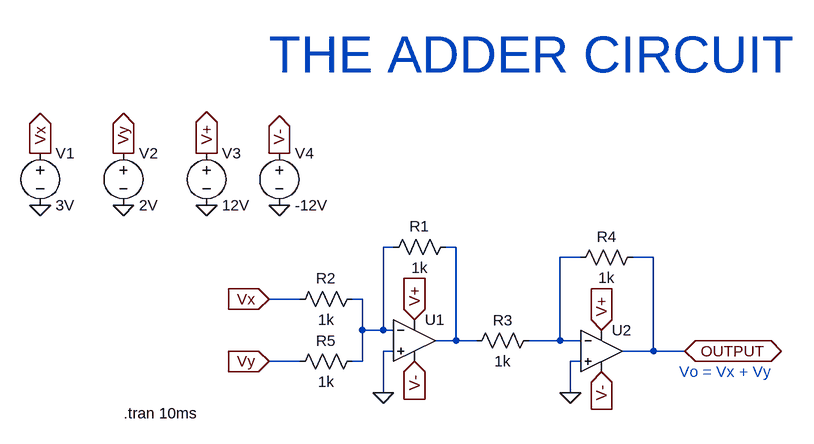
[diagram p0: schematic Adder.asc]
Adder.asc, the LTspice schematic file:
Version 4
SHEET 1 880 680
WIRE 16 32 0 32
WIRE 112 32 96 32
WIRE 304 48 272 48
WIRE 416 48 384 48
WIRE -128 112 -176 112
WIRE -32 112 -48 112
WIRE -32 160 -32 112
WIRE 0 160 0 32
WIRE 0 160 -32 160
WIRE 16 160 0 160
WIRE 112 176 112 32
WIRE 112 176 80 176
WIRE 144 176 112 176
WIRE 272 176 272 48
WIRE 272 176 224 176
WIRE 304 176 272 176
WIRE 16 192 0 192
WIRE 416 192 416 48
WIRE 416 192 368 192
WIRE 464 192 416 192
WIRE -128 208 -176 208
WIRE -32 208 -32 160
WIRE -32 208 -48 208
WIRE 304 208 288 208
WIRE 0 256 0 192
WIRE 288 256 288 208
FLAG 0 256 0
FLAG 288 256 0
FLAG -528 -32 0
FLAG -400 -32 0
FLAG -272 -32 0
FLAG -160 -32 0
FLAG -528 -112 Vx
IOPIN -528 -112 Out
FLAG -400 -112 Vy
IOPIN -400 -112 Out
FLAG -272 -112 V+
IOPIN -272 -112 Out
FLAG -160 -112 V-
IOPIN -160 -112 Out
FLAG -176 112 Vx
IOPIN -176 112 In
FLAG -176 208 Vy
IOPIN -176 208 In
FLAG 48 144 V+
IOPIN 48 144 In
FLAG 336 160 V+
IOPIN 336 160 In
FLAG 48 208 V-
IOPIN 48 208 In
FLAG 336 224 V-
IOPIN 336 224 In
FLAG 464 192 OUTPUT
IOPIN 464 192 BiDir
SYMBOL Opamps\\UniversalOpamp2 48 176 R0
SYMATTR InstName U1
SYMBOL res 112 16 R90
WINDOW 0 0 56 VBottom 2
WINDOW 3 32 56 VTop 2
SYMATTR InstName R1
SYMATTR Value 1k
SYMBOL res 240 160 R90
WINDOW 0 0 56 VBottom 2
WINDOW 3 32 56 VTop 2
SYMATTR InstName R3
SYMATTR Value 1k
SYMBOL res 400 32 R90
WINDOW 0 0 56 VBottom 2
WINDOW 3 32 56 VTop 2
SYMATTR InstName R4
SYMATTR Value 1k
SYMBOL Opamps\\UniversalOpamp2 336 192 R0
SYMATTR InstName U2
SYMBOL res -32 192 R90
WINDOW 0 0 56 VBottom 2
WINDOW 3 32 56 VTop 2
SYMATTR InstName R5
SYMATTR Value 1k
SYMBOL res -32 96 R90
WINDOW 0 0 56 VBottom 2
WINDOW 3 32 56 VTop 2
SYMATTR InstName R2
SYMATTR Value 1k
SYMBOL voltage -528 -128 R0
SYMATTR InstName V1
SYMATTR Value 3V
SYMBOL voltage -400 -128 R0
WINDOW 123 0 0 Left 2
WINDOW 39 0 0 Left 2
SYMATTR InstName V2
SYMATTR Value 2V
SYMBOL voltage -272 -128 R0
WINDOW 123 0 0 Left 2
WINDOW 39 0 0 Left 2
SYMATTR InstName V3
SYMATTR Value 12V
SYMBOL voltage -160 -128 R0
WINDOW 123 0 0 Left 2
WINDOW 39 0 0 Left 2
SYMATTR InstName V4
SYMATTR Value -12V
TEXT 456 224 Left 2 ;Vo = Vx + Vy
TEXT -400 288 Left 2 !.tran 10ms
TEXT -176 -264 Left 6 ;THE ADDER CIRCUIT

The netlist it stands for:
* Adder.asc
XU1 0 N001 V+ V- N002 level.2 Avol=1Meg GBW=10Meg Slew=10Meg ilimit=25m rail=0 Vos=0 phimargin=45 en=0 enk=0 in=0 ink=0 Rin=500Meg  ; pins IN+ IN- V+ V- OUT
R1 N002 N001 1k
R3 N003 N002 1k
R4 OUTPUT N003 1k
XU2 0 N003 V+ V- OUTPUT level.2 Avol=1Meg GBW=10Meg Slew=10Meg ilimit=25m rail=0 Vos=0 phimargin=45 en=0 enk=0 in=0 ink=0 Rin=500Meg  ; pins IN+ IN- V+ V- OUT
R5 N001 Vy 1k
R2 N001 Vx 1k
V1 Vx 0 3V
V2 Vy 0 2V
V3 V+ 0 12V
V4 V- 0 -12V
* Vo = Vx + Vy
.tran 10ms
* THE ADDER CIRCUIT
.lib UniversalOpamps2.sub
.backanno
.end